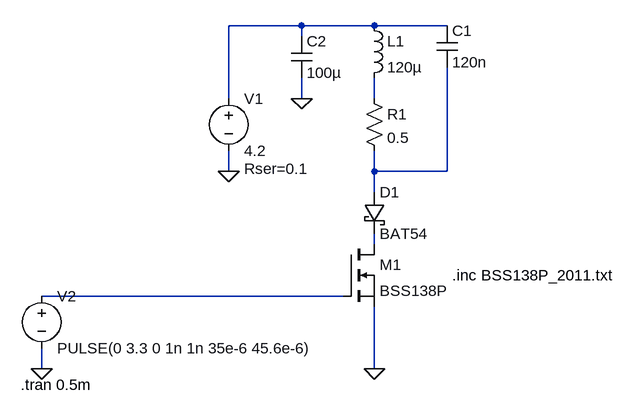
[diagram p0: schematic PiezoDriver.asc]
PiezoDriver.asc, the LTspice schematic file:
Version 4
SHEET 1 1060 680
WIRE 240 -208 128 -208
WIRE 352 -208 240 -208
WIRE 464 -208 352 -208
WIRE 240 -192 240 -208
WIRE 128 -96 128 -208
WIRE 240 -96 240 -128
WIRE 352 -96 352 -128
WIRE 128 16 128 -16
WIRE 352 16 352 -16
WIRE 464 16 464 -144
WIRE 464 16 352 16
WIRE 352 48 352 16
WIRE 352 128 352 112
WIRE 304 208 -160 208
WIRE -160 320 -160 288
WIRE 352 320 352 224
FLAG 128 16 0
FLAG -160 320 0
FLAG 352 320 0
FLAG 240 -96 0
SYMBOL voltage 128 -112 R0
WINDOW 123 0 0 Left 0
WINDOW 39 24 124 Left 2
SYMATTR SpiceLine Rser=0.1
SYMATTR InstName V1
SYMATTR Value 4.2
SYMBOL voltage -160 192 R0
WINDOW 123 0 0 Left 0
WINDOW 39 0 0 Left 0
SYMATTR InstName V2
SYMATTR Value PULSE(0 3.3 0 1n 1n 35e-6 45.6e-6)
SYMBOL nmos 304 128 R0
SYMATTR InstName M1
SYMATTR Value BSS138P
SYMATTR Prefix X
SYMBOL schottky 336 48 R0
SYMATTR InstName D1
SYMATTR Value BAT54
SYMATTR Description Diode
SYMATTR Type diode
SYMBOL ind 336 -224 R0
SYMATTR InstName L1
SYMATTR Value 120µ
SYMBOL cap 448 -208 R0
SYMATTR InstName C1
SYMATTR Value 120n
SYMBOL res 336 -112 R0
SYMATTR InstName R1
SYMATTR Value 0.5
SYMBOL cap 224 -192 R0
SYMATTR InstName C2
SYMATTR Value 100µ
SYMATTR SpiceLine Rser=0.01
TEXT 472 176 Left 2 !.inc BSS138P_2011.txt
TEXT -192 344 Left 2 !.tran 0.5m

The netlist it stands for:
* PiezoDriver.asc
V1 N001 0 4.2 Rser=0.1
V2 N005 0 PULSE(0 3.3 0 1n 1n 35e-6 45.6e-6)
XM1 N004 N005 0 BSS138P  ; pins D G S
D1 N003 N004 BAT54
L1 N001 N002 120µ
C1 N001 N003 120n
R1 N002 N003 0.5
C2 N001 0 100µ Rser=0.01
.model D D
.lib standard.dio
.inc BSS138P_2011.txt
.tran 0.5m
.backanno
.end